# Altium schematic sheet DIY Teensy 3.6.SchDoc: Secure CAN Logger
size Letter portrait; Organization: Dr. Jeremy Daily; Address1: Systems Engineering; Address2: Engineering A202; Address3: Fort Collins, CO 80523; Address4: www.engr.colostate.edu/se/; DocumentNumber: DIY Teensy 3.6 with K66; Revision: 3c; SheetNumber: 3; SheetTotal: 3
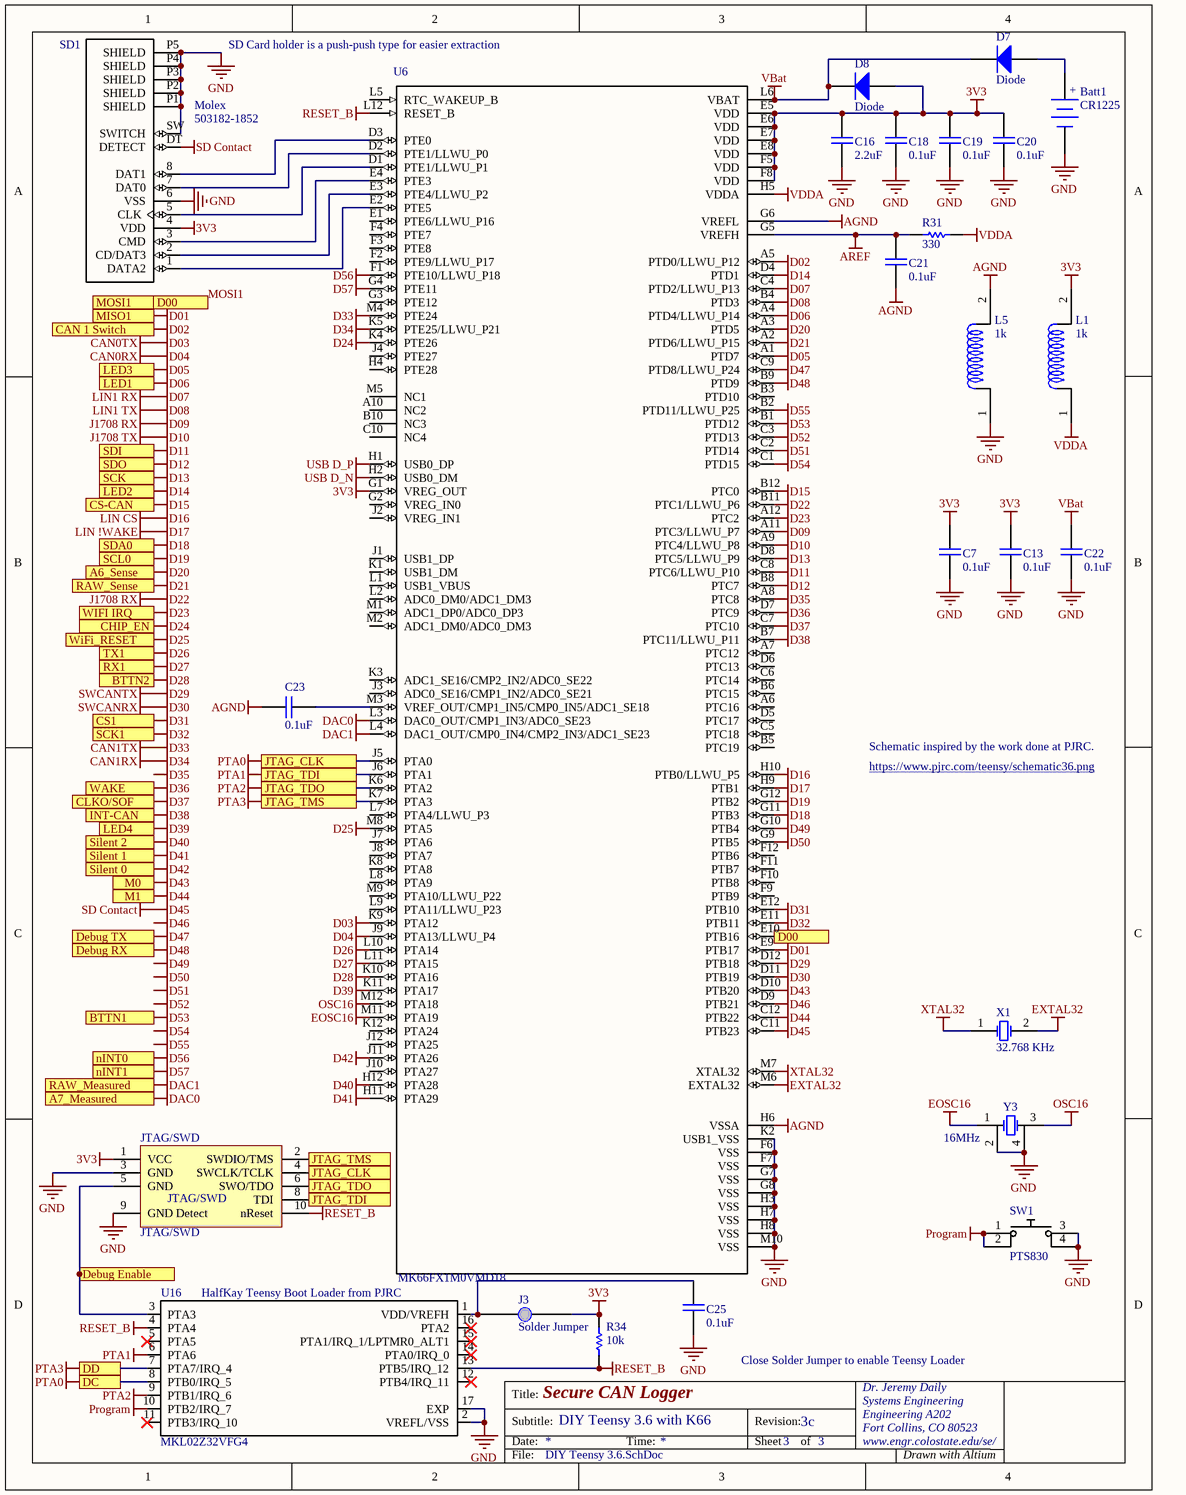
[diagram p0: DIY Teensy 3.6.SchDoc]

## Parts
Batt1  CR1225  [Battery Clip - CR1225]
C7  0.1uF  [0603]
C13  0.1uF  [0603]
C16  2.2uF  [0603]
C18  0.1uF  [0603]
C19  0.1uF  [0603]
C20  0.1uF  [0603]
C21  0.1uF  [0603]
C22  0.1uF  [0603]
C23  0.1uF  [0603]
C25  0.1uF  [0603]
D7  Diode  [CST2C]
D8  Diode  [CST2C]
J3  Solder Jumper  [Solder Jumper]
JTAG/SWD  JTAG/SWD  [JTAG 10-pin Header]
L1  1k  [0603]
L5  1k  [0603]
R31  330  [0603]
R34  10k  [0603]
SD1  503182-1852  Manufacturer: Molex  [*MOLEX_503182-1852_503182-1852(Primary)]
SW1  PTS830  [Switch PTS830]
U6  MK66FX1M0VMD18  [*BGA144C100P12X12_1300X1300X170_MK66FX1M0VMD18(Primary)]
U16  MKL02Z32VFG4  [*QFN50P300X300X65-17N]
X1  32.768 KHz  [XTAL 2-pad Small]
Y3  16MHz  [XTAL 4 pad]

## Ports
A6_Sense, A7_Measured, BTTN1, BTTN2, CAN 1 Switch, CHIP_EN, CLKO/SOF, CS1, CS-CAN, D00, DC, DD, Debug Enable, Debug RX, Debug TX, INT-CAN, JTAG_CLK, JTAG_TDI, JTAG_TDO, JTAG_TMS, LED1, LED2, LED3, LED4, M0, M1, MISO1, MOSI1, nINT0, nINT1, RAW_Measured, RAW_Sense, RX1, SCK, SCK1, SCL0, SDA0, SDI, SDO, Silent 0, Silent 1, Silent 2, TX1, WAKE, WIFI IRQ, WiFi_RESET

## Nets
3V3: C7.2 C13.2 C16.2 C18.2 C19.2 C20.2 D8.1(A) J3.2 JTAG/SWD.1(VCC) L1.2 R34.1 SD1.4(VDD) U6.E5(VDD) U6.E6(VDD) U6.E7(VDD) U6.E8(VDD) U6.F5(VDD) U6.F8(VDD) U6.G1(VREG_OUT)
AGND: C21.1 C23.1 L5.2 U6.G6(VREFL) U6.H6(VSSA)
AREF: C21.2 R31.2 U6.G5(VREFH)
CAN0RX: U6.J9(PTA13/LLWU_P4)  [also labelled D04]
CAN0TX: U6.K9(PTA12)  [also labelled D03]
CAN1RX: U6.K5(PTE25/LLWU_P21)  [also labelled D34]
CAN1TX: U6.M4(PTE24)  [also labelled D33]
D01: U6.E9(PTB17) ; port MISO1
D02: U6.A5(PTD0/LLWU_P12) ; port CAN 1 Switch
D05: U6.A1(PTD7) ; port LED3
D06: U6.A4(PTD4/LLWU_P14) ; port LED1
D07: U6.C4(PTD2/LLWU_P13)  [also labelled LIN1 RX]
D08: U6.B4(PTD3)  [also labelled LIN1 TX]
D09: U6.A11(PTC3/LLWU_P7) U6.B11(PTC1/LLWU_P6)  [also labelled D22, J1708 RX]
D10: U6.A9(PTC4/LLWU_P8)  [also labelled J1708 TX]
D11: U6.C8(PTC6/LLWU_P10) ; port SDI
D12: U6.B8(PTC7) ; port SDO
D13: U6.D8(PTC5/LLWU_P9) ; port SCK
D14: U6.D4(PTD1) ; port LED2
D15: U6.B12(PTC0) ; port CS-CAN
D16: U6.H10(PTB0/LLWU_P5)  [also labelled LIN CS]
D17: U6.H9(PTB1)  [also labelled LIN !WAKE]
D18: U6.G11(PTB3) ; port SDA0
D19: U6.G12(PTB2) ; port SCL0
D20: U6.A3(PTD5) ; port A6_Sense
D21: U6.A2(PTD6/LLWU_P15) ; port RAW_Sense
D23: U6.A12(PTC2) ; port WIFI IRQ
D24: U6.K4(PTE26) ; port CHIP_EN
D25: U6.M8(PTA5) ; port WiFi_RESET
D26: U6.L10(PTA14) ; port TX1
D27: U6.L11(PTA15) ; port RX1
D28: U6.K10(PTA16) ; port BTTN2
D29: U6.D12(PTB18)  [also labelled SWCANTX]
D30: U6.D11(PTB19)  [also labelled SWCANRX]
D31: U6.E12(PTB10) ; port CS1
D32: U6.E11(PTB11) ; port SCK1
D35: U6.A8(PTC8)
D36: U6.D7(PTC9) ; port WAKE
D37: U6.C7(PTC10) ; port CLKO/SOF
D38: U6.B7(PTC11/LLWU_P11) ; port INT-CAN
D39: U6.K11(PTA17) ; port LED4
D40: U6.H12(PTA28) ; port Silent 2
D41: U6.H11(PTA29) ; port Silent 1
D42: U6.J11(PTA26) ; port Silent 0
D43: U6.D10(PTB20) ; port M0
D44: U6.C12(PTB22) ; port M1
D45: SD1.DT(DETECT) U6.C11(PTB23)  [also labelled SD Contact]
D46: U6.D9(PTB21)
D47: U6.C9(PTD8/LLWU_P24) ; port Debug TX
D48: U6.B9(PTD9) ; port Debug RX
D49: U6.G10(PTB4)
D50: U6.G9(PTB5)
D51: U6.C2(PTD14)
D52: U6.C3(PTD13)
D53: U6.B1(PTD12) ; port BTTN1
D54: U6.C1(PTD15)
D55: U6.B2(PTD11/LLWU_P25)
D56: U6.F1(PTE10/LLWU_P18) ; port nINT0
D57: U6.G4(PTE11) ; port nINT1
DAC0: U6.L3(DAC0_OUT/CMP1_IN3/ADC0_SE23) ; port A7_Measured
DAC1: U6.L4(DAC1_OUT/CMP0_IN4/CMP2_IN3/ADC1_SE23) ; port RAW_Measured
EOSC16: U6.M11(PTA19) Y3.1(OSC1)
EXTAL32: U6.M6(EXTAL32) X1.2(OSC2)
GND: Batt1.2(-) C7.1 C13.1 C16.1 C18.1 C19.1 C20.1 C22.1 C25.1 JTAG/SWD.3(GND) JTAG/SWD.9(GND_Detect) L5.1 SD1.6(VSS) SD1.P1(SHIELD) SD1.P2(SHIELD) SD1.P3(SHIELD) SD1.P4(SHIELD) SD1.P5(SHIELD) SD1.SW(SWITCH) SW1.3 SW1.4 U6.F6(VSS) U6.F7(VSS) U6.G7(VSS) U6.G8(VSS) U6.H3(VSS) U6.H7(VSS) U6.H8(VSS) U6.K2(USB1_VSS) U6.M10(VSS) U16.2(VREFL/VSS) U16.17(EXP) Y3.2(OSC2) Y3.4(GND)
OSC16: U6.M12(PTA18) Y3.3(OSC2)
Program: SW1.1 SW1.2 U16.10(PTB2/IRQ_7)
PTA0: JTAG/SWD.4(SWCLK/TCLK) U6.J5(PTA0) U16.8(PTB0/IRQ_5) ; port DC, port JTAG_CLK
PTA1: JTAG/SWD.8(TDI) U6.J6(PTA1) U16.6(PTA6) ; port JTAG_TDI
PTA2: JTAG/SWD.6(SWO/TDO) U6.K6(PTA2) U16.9(PTB1/IRQ_6) ; port JTAG_TDO
PTA3: JTAG/SWD.2(SWDIO/TMS) U6.K7(PTA3) U16.7(PTA7/IRQ_4) ; port DD, port JTAG_TMS
RESET_B: JTAG/SWD.10(nReset) R34.2 U6.L12(RESET_B) U16.4(PTA4) U16.13(PTB5/IRQ_12)
USB D_N: U6.H2(USB0_DM)
USB D_P: U6.H1(USB0_DP)
VBat: C22.2 D7.2(K) D8.2(K) U6.L6(VBAT)
VDDA: L1.1 R31.1 U6.H5(VDDA)
XTAL32: U6.M7(XTAL32) X1.1(OSC1)
Debug Enable: JTAG/SWD.5(GND) U16.3(PTA3) ; port Debug Enable
MOSI1: U6.E10(PTB16) ; port MOSI1, port D00
NetBatt1_1: Batt1.1(+) D7.1(A)
NetC23_2: C23.2 U6.M3(VREF_OUT/CMP1_IN5/CMP0_IN5/ADC1_SE18)
NetC25_2: C25.2 J3.1 U16.1(VDD/VREFH)
NetSD1_1: SD1.1(DATA2) U6.E2(PTE5)
NetSD1_2: SD1.2(CD/DAT3) U6.E3(PTE4/LLWU_P2)
NetSD1_3: SD1.3(CMD) U6.E4(PTE3)
NetSD1_5: SD1.5(CLK) U6.D1(PTE1/LLWU_P1)
NetSD1_7: SD1.7(DAT0) U6.D2(PTE1/LLWU_P0)
NetSD1_8: SD1.8(DAT1) U6.D3(PTE0)

Not connected (* = marked no-connect by the designer): U6 A6(PTC16) A7(PTC12) A10(NC2) B3(PTD10) B5(PTC19) B6(PTC15) B10(NC3) C5(PTC18) C6(PTC14) C10(NC4) D5(PTC17) D6(PTC13) E1(PTE6/LLWU_P16) F2(PTE9/LLWU_P17) F3(PTE8) F4(PTE7) F9(PTB9) F10(PTB8) F11(PTB7) F12(PTB6) G2(VREG_IN0) G3(PTE12) H4(PTE28) J1(USB1_DP) J2(VREG_IN1) J3(ADC0_SE16/CMP1_IN2/ADC0_SE21) J4(PTE27) J7(PTA6) J8(PTA7) J10(PTA27) J12(PTA25) K1(USB1_DM) K3(ADC1_SE16/CMP2_IN2/ADC0_SE22) K8(PTA8) K12(PTA24) L1(USB1_VBUS) L2(ADC0_DM0/ADC1_DM3) L5(RTC_WAKEUP_B) L7(PTA4/LLWU_P3) L8(PTA9) L9(PTA11/LLWU_P23) M1(ADC1_DP0/ADC0_DP3) M2(ADC1_DM0/ADC0_DM3) M5(NC1) M9(PTA10/LLWU_P22); U16 5(PTA5)* 11(PTB3/IRQ_10)* 12(PTB4/IRQ_11)* 14(PTA0/IRQ_0)* 15(PTA1/IRQ_1/LPTMR0_ALT1)* 16(PTA2)*

## Notes on the sheet
- SD Card holder is a push-push type for easier extraction
- Schematic inspired by the work done at PJRC.
- https://www.pjrc.com/teensy/schematic36.png
- (near U16) HalfKay Teensy Boot Loader from PJRC
- Close Solder Jumper to enable Teensy Loader
- Labels drawn without touching a wire or pin: D35, D46, D49, D50, D51, D52, D54, D55
- Title:
- Subtitle:
- Date:
- Time:
- Revision:
- Sheet
- of
- File:
- Drawn with Altium

## Library data of the parts
Batt1 = CR2032 Battery Holder: Lithium Battery Non-Rechargeable (Primary) 3V Coin, 12.5mm; Manufacturer: Linx; PartNumber: BAT-HLD-012-SMT; Supplier 1: Digi-Key; Supplier Part Number 1: BAT-HLD-012-SMT-ND
C7 C13 C18-C23 C25 = Cap: CAP CER 0.1UF 50V X7R 0603; Manufacturer: KEMET; PartNumber: C0603C104K5RACAUTO; Alternative: Acceptable; Supplier 1: Digi-Key; Supplier Part Number 1: 399-6856-1-ND
C16 = Cap: 2.2µF ±10% 6.3V Ceramic Capacitor X5R 0603 (1608 Metric); Manufacturer: Taiyo Yuden; PartNumber: JMK107BJ225KAHT; Alternative: Acceptable; Supplier 1: Digi-Key; Supplier Part Number 1: 587-3386-1-ND
D7 D8 = Diode: Default Diode; Manufacturer: Toshiba Semiconductor and Storage; PartNumber: CCS15S30L3FCT-ND; Supplier 1: Digi-Key; Supplier Part Number 1: CCS15S30L3FCT-ND
JTAG/SWD = JTAG Cortex: Connector Header Surface Mount 10 position 0.050" (1.27mm); Manufacturer: CNC Tech; PartNumber: 3221-10-0300-00; Supplier 1: Digi-Key; Supplier Part Number 1: 1175-1735-ND
L1 L5 = Ferrite Bead: Ferrite Beads Multi-Layer Power 1KOhm 25% 100MHz 1A 200mOhm DCR 0603 Automotive T/R; Manufacturer: Murata; PartNumber: BLM18KG102SZ1D; Alternative: Acceptable; Supplier 1: Digi-Key; Supplier Part Number 1: 490-17350-1-ND
R31 = Chip Resistor: 330 Ohms ±1% 0.1W, 1/10W Chip Resistor 0603 (1608 Metric) Automotive AEC-Q200, High Voltage Thick Film; Manufacturer: Rohm Semiconductor; PartNumber: KTR03EZPF3300; Alternative: Acceptable; Supplier 1: Digi-Key; Supplier Part Number 1: RHM330AYCT-ND
R34 = Chip Resistor: 10 kOhms ±1% 0.1W, 1/10W Chip Resistor 0603 (1608 Metric) Automotive AEC-Q200, High Voltage Thick Film; Manufacturer: Rohm Semiconductor; PartNumber: KTR03EZPF1002; Alternative: Acceptable; Supplier 1: Digi-Key; Supplier Part Number 1: RHM10.0KAYCT-ND
SD1 = 503182-1852: MICRO SD NORMAL ULTRALOWPRO8CKTE; PartNumber: 5031821852; Supplier Part Number 1: WM12834CT-ND; Supplier 1: Digi-Key
SW1 = Switch - Tactile_2: Tactile Switch SPST-NO Top Actuated Surface Mount; Manufacturer: C & K Components; PartNumber: PTS830GM140 SMTR LFS; Supplier 1: Digi-Key; Supplier Part Number 1: CKN10587CT-ND
U6 = MK66FX1M0VMD18: Kinetis K66: 180MHz Cortex-M4F MCU, 1.2MB Flash, 256KB SRAM, 2xUSB, Ethernet, 144-MAPBGA; Manufacturer: NXP USA Inc.; PartNumber: MK66FX1M0VMD18; Supplier 1: Digi-Key; Supplier Part Number 1: 568-13335-ND
U16 = MKL02Z32VFG4: 32 Bit Microcontroller, Kinetis L Series Ultra Low Power, ARM Cortex-M0+, 48 MHz, 32 KB, 4 KB, 16; Manufacturer: PJRC; PartNumber: Pre Programmed MKL02Z32VFG4; Alternative: Sole Source; Supplier 1: PJRC; Supplier Part Number 1: IC_MKL02Z32_QFN16
X1 = Crystal Oscillator: Canned Oscillator; Manufacturer: ECS Inc.; PartNumber: ECX-.327-CDX-1293; Supplier 1: Digi-Key; Supplier Part Number 1: XC2292CT-ND
Y3 = Crystal with Ground: 16MHz ±30ppm Crystal 18pF 80 Ohms 4-SMD, No Lead; Manufacturer: ECS Inc.; PartNumber: XC2866CT-ND; Supplier Part Number 1: XC2866CT-ND; Supplier 1: Digi-Key